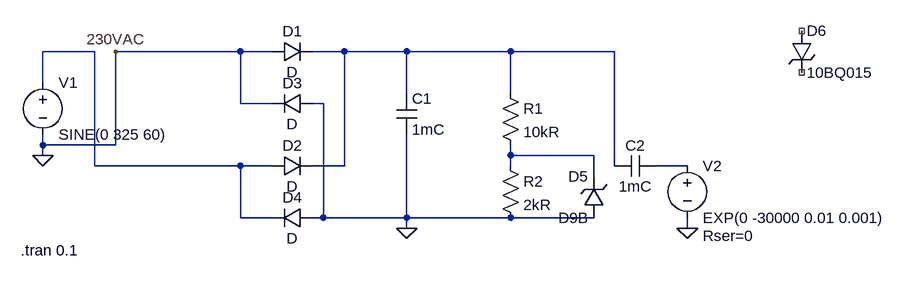
[diagram p0: schematic Draft2.asc]
Draft2.asc, the LTspice schematic file:
Version 4
SHEET 1 1384 680
WIRE 64 32 -16 32
WIRE 288 32 96 32
WIRE 336 32 288 32
WIRE 448 32 400 32
WIRE 544 32 448 32
WIRE 704 32 544 32
WIRE 864 32 704 32
WIRE -16 80 -16 32
WIRE 544 96 544 32
WIRE 704 96 704 32
WIRE 288 112 288 32
WIRE 336 112 288 112
WIRE 416 112 400 112
WIRE -16 176 -16 160
WIRE 96 176 96 32
WIRE 96 176 -16 176
WIRE -16 192 -16 176
WIRE 704 192 704 176
WIRE 832 192 704 192
WIRE 64 208 64 32
WIRE 288 208 64 208
WIRE 336 208 288 208
WIRE 448 208 448 32
WIRE 448 208 400 208
WIRE 704 208 704 192
WIRE 864 208 864 32
WIRE 976 208 928 208
WIRE 832 224 832 192
WIRE 288 288 288 208
WIRE 336 288 288 288
WIRE 416 288 416 112
WIRE 416 288 400 288
WIRE 544 288 544 160
WIRE 544 288 416 288
WIRE 704 288 544 288
WIRE 832 288 704 288
WIRE 544 304 544 288
WIRE 976 304 976 288
FLAG -16 192 0
FLAG 96 32 230VAC
FLAG 544 304 0
FLAG 976 304 0
SYMBOL voltage -16 64 R0
WINDOW 123 0 0 Left 0
WINDOW 39 0 0 Left 0
SYMATTR InstName V1
SYMATTR Value SINE(0 325 60)
SYMBOL diode 336 48 R270
WINDOW 0 32 32 VTop 2
WINDOW 3 0 32 VBottom 2
SYMATTR InstName D1
SYMBOL diode 336 224 R270
WINDOW 0 32 32 VTop 2
WINDOW 3 0 32 VBottom 2
SYMATTR InstName D2
SYMBOL diode 400 96 R90
WINDOW 0 0 32 VBottom 2
WINDOW 3 32 32 VTop 2
SYMATTR InstName D3
SYMBOL diode 400 272 R90
WINDOW 0 0 32 VBottom 2
WINDOW 3 32 32 VTop 2
SYMATTR InstName D4
SYMBOL cap 528 96 R0
SYMATTR InstName C1
SYMATTR Value 1mC
SYMBOL res 688 80 R0
SYMATTR InstName R1
SYMATTR Value 10kR
SYMBOL res 688 192 R0
SYMATTR InstName R2
SYMATTR Value 2kR
SYMBOL zener 848 288 R180
WINDOW 0 24 64 Left 2
WINDOW 3 24 0 Left 2
SYMATTR InstName D5
SYMATTR Value D9B
SYMBOL voltage 976 192 R0
WINDOW 123 0 0 Left 0
WINDOW 39 24 124 Left 2
SYMATTR InstName V2
SYMATTR Value EXP(0 -30000 0.01 0.001)
SYMATTR SpiceLine Rser=0
SYMBOL cap 928 192 R90
WINDOW 0 0 32 VBottom 2
WINDOW 3 32 32 VTop 2
SYMATTR InstName C2
SYMATTR Value 1mC
SYMBOL TVSdiode 1136 0 R0
SYMATTR InstName D6
SYMATTR Value 10BQ015
TEXT -50 338 Left 2 !.tran 0.1

The netlist it stands for:
* Draft2.asc
V1 N001 0 SINE(0 325 60)
D1 0 N002 D
D2 N001 N002 D
D3 0 0 D
D4 0 N001 D
C1 N002 0 1mC
R1 N002 N003 10kR
R2 N003 0 2kR
D5 0 N003 D9B
V2 N004 0 EXP(0 -30000 0.01 0.001) Rser=0
C2 N004 N002 1mC
D6 NC_01 NC_02 10BQ015
.model D D
.lib standard.dio
.tran 0.1
.backanno
.end